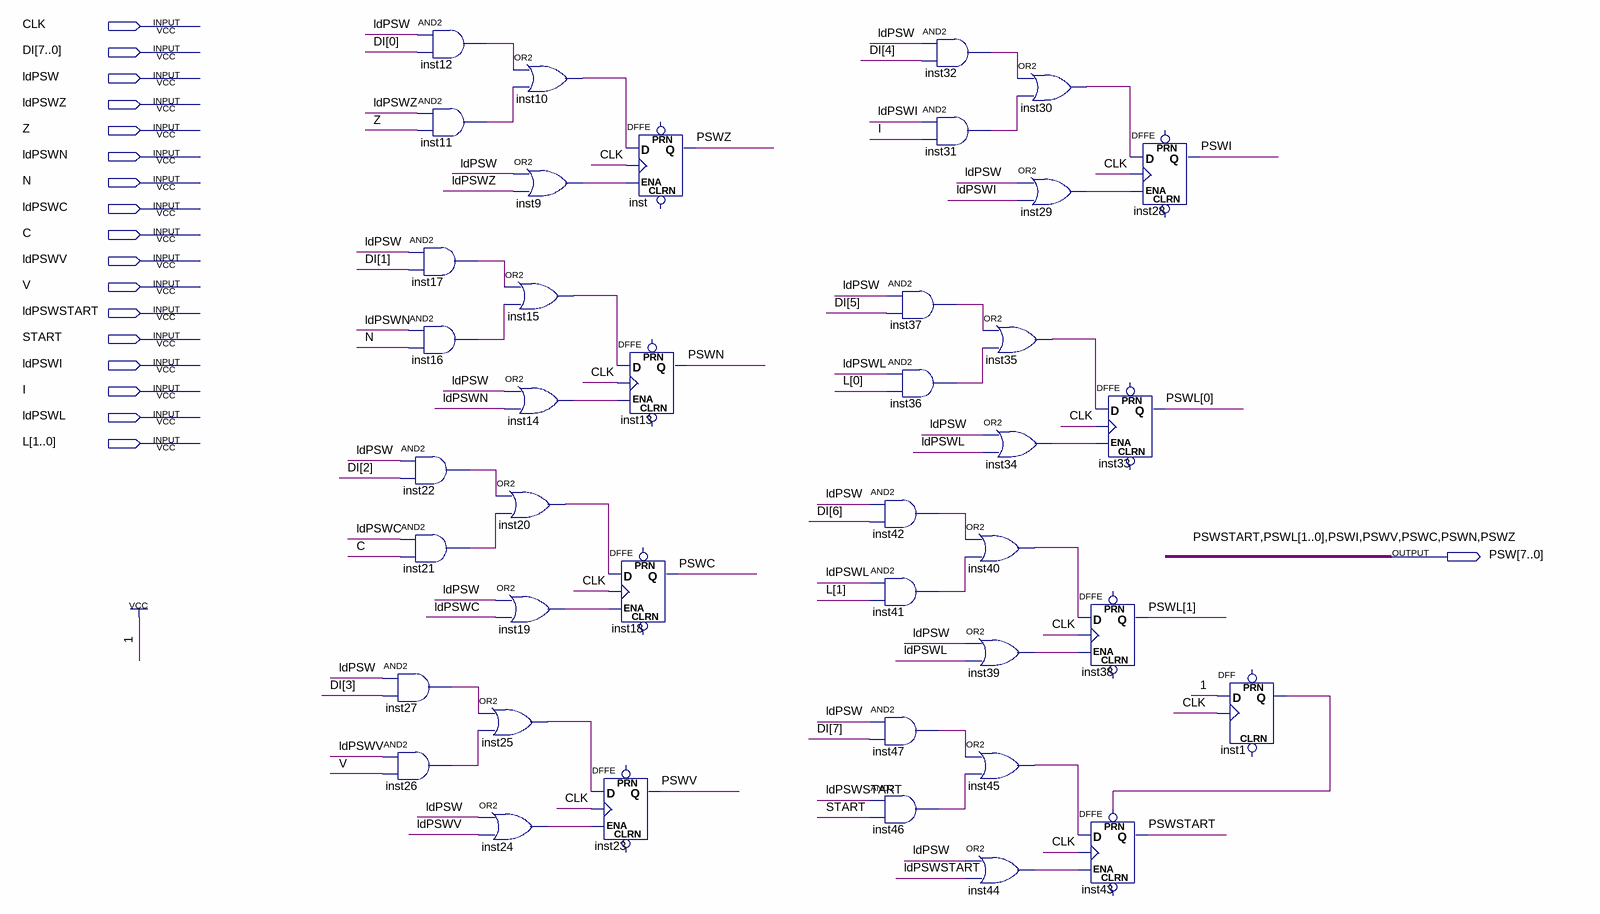
[diagram p0: schematic sheet]
// Quartus schematic PSW.bdf as structural Verilog: 41 symbols, 18 pins
module PSW (
  input  CLK,
  input  [7:0] DI,
  input  ldPSW,
  input  ldPSWZ,
  input  Z,
  input  ldPSWN,
  input  N,
  input  ldPSWC,
  input  C,
  input  ldPSWV,
  input  V,
  input  ldPSWSTART,
  input  START,
  input  ldPSWI,
  input  I,
  input  ldPSWL,
  input  [1:0] L,
  output [7:0] PSW
);

  wire inst1_q, inst9_out, inst10_out, inst11_out, inst12_out, inst14_out, inst15_out, inst16_out,
       inst17_out, inst19_out, inst20_out, inst21_out, inst22_out, inst24_out, inst25_out, inst26_out,
       inst27_out, inst29_out, inst30_out, inst31_out, inst32_out, inst34_out, inst35_out, inst36_out,
       inst37_out, inst39_out, inst40_out, inst41_out, inst42_out, inst44_out, inst45_out, inst46_out,
       inst47_out;

  and inst12 (inst12_out, ldPSW, DI[0]);
  and inst11 (inst11_out, ldPSWZ, Z);
  and inst17 (inst17_out, ldPSW, DI[1]);
  and inst16 (inst16_out, ldPSWN, N);
  and inst22 (inst22_out, ldPSW, DI[2]);
  and inst21 (inst21_out, ldPSWC, C);
  and inst27 (inst27_out, ldPSW, DI[3]);
  and inst26 (inst26_out, ldPSWV, V);
  or inst10 (inst10_out, inst12_out, inst11_out);
  or inst9 (inst9_out, ldPSW, ldPSWZ);
  or inst15 (inst15_out, inst17_out, inst16_out);
  or inst14 (inst14_out, ldPSW, ldPSWN);
  or inst20 (inst20_out, inst22_out, inst21_out);
  or inst19 (inst19_out, ldPSW, ldPSWC);
  or inst25 (inst25_out, inst27_out, inst26_out);
  or inst24 (inst24_out, ldPSW, ldPSWV);
  DFFE inst (.D(inst10_out), .CLK(CLK), .ENA(inst9_out), .Q(PSW[0]));  // open: PRN, CLRN
  DFFE inst13 (.D(inst15_out), .CLK(CLK), .ENA(inst14_out), .Q(PSW[1]));  // open: PRN, CLRN
  DFFE inst18 (.D(inst20_out), .CLK(CLK), .ENA(inst19_out), .Q(PSW[2]));  // open: PRN, CLRN
  DFFE inst23 (.D(inst25_out), .CLK(CLK), .ENA(inst24_out), .Q(PSW[3]));  // open: PRN, CLRN
  and inst32 (inst32_out, ldPSW, DI[4]);
  and inst31 (inst31_out, ldPSWI, I);
  and inst37 (inst37_out, ldPSW, DI[5]);
  and inst36 (inst36_out, ldPSWL, L[0]);
  and inst42 (inst42_out, ldPSW, DI[6]);
  and inst41 (inst41_out, ldPSWL, L[1]);
  and inst47 (inst47_out, ldPSW, DI[7]);
  and inst46 (inst46_out, ldPSWSTART, START);
  or inst35 (inst35_out, inst37_out, inst36_out);
  or inst34 (inst34_out, ldPSW, ldPSWL);
  or inst40 (inst40_out, inst42_out, inst41_out);
  or inst39 (inst39_out, ldPSW, ldPSWL);
  or inst45 (inst45_out, inst47_out, inst46_out);
  or inst44 (inst44_out, ldPSW, ldPSWSTART);
  or inst30 (inst30_out, inst32_out, inst31_out);
  or inst29 (inst29_out, ldPSW, ldPSWI);
  DFFE inst28 (.D(inst30_out), .CLK(CLK), .ENA(inst29_out), .Q(PSW[4]));  // open: PRN, CLRN
  DFFE inst33 (.D(inst35_out), .CLK(CLK), .ENA(inst34_out), .Q(PSW[5]));  // open: PRN, CLRN
  DFFE inst38 (.D(inst40_out), .CLK(CLK), .ENA(inst39_out), .Q(PSW[6]));  // open: PRN, CLRN
  DFFE inst43 (.PRN(inst1_q), .D(inst45_out), .CLK(CLK), .ENA(inst44_out), .Q(PSW[7]));  // open: CLRN
  DFF inst1 (.CLK(CLK), .D(1'b1), .Q(inst1_q));  // open: CLRN, PRN

  // Other names for the same wires on the sheet: PSWC = PSW[2]; PSWI = PSW[4]; PSWL[1:0] = PSW[6:5]; PSWN = PSW[1];
  //   PSWSTART = PSW[7]; PSWV = PSW[3]; PSWZ = PSW[0]
endmodule
